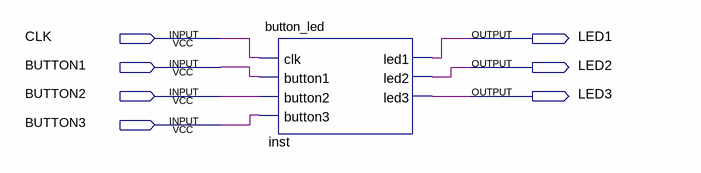
[diagram p0: schematic sheet]
// Quartus schematic Controlling_Triple_LED_using_Momentary_Switch_Control.bdf as structural Verilog: 1 symbols, 7 pins
module Controlling_Triple_LED_using_Momentary_Switch_Control (
  input  CLK,
  input  BUTTON1,
  input  BUTTON2,
  input  BUTTON3,
  output LED1,
  output LED2,
  output LED3
);

  button_led inst (
    .clk(CLK), .button1(BUTTON1), .button2(BUTTON2), .button3(BUTTON3), .led1(LED1), .led2(LED2), .led3(LED3));
endmodule
